# EAGLE design inv_pendulum (EAGLE 7.6.0)
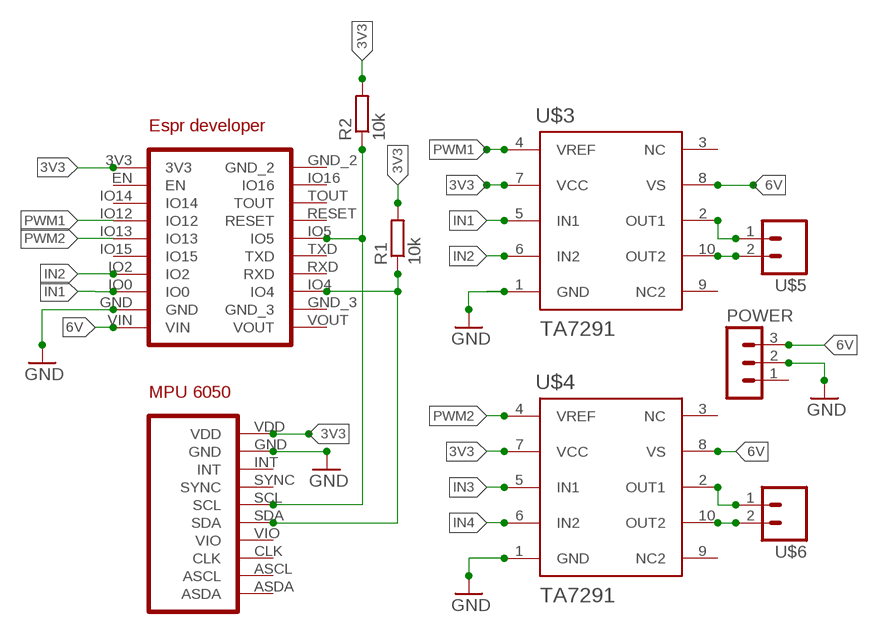
[diagram p0: schematic, sheet 1]

## Parts
POWER  MA03-1  [MA03-1]
R1  10k  R-EU_0204/7  [0204/7]
R2  10k  R-EU_0204/7  [0204/7]
U$1  MPU6050  [MPU6050]
U$2  ESPR_DEVELOPER  [ESPR_DEV]
U$3  TA7291  [HSIP10]
U$4  TA7291  [HSIP10]
U$5  M02LOCK_LONGPADS  [1X02_LOCK_LONGPADS]
U$6  M02LOCK_LONGPADS  [1X02_LOCK_LONGPADS]

## Nets
3V3: R1.2 R2.2 U$1.VDD U$2.3V3 U$3.7(VCC) U$4.7(VCC)
6V: POWER.3 U$2.VIN U$3.8(VS) U$4.8(VS)
GND: POWER.2 U$1.GND U$2.GND U$3.1(GND) U$4.1(GND)
IN1: U$2.IO0 U$3.5(IN1)
IN2: U$2.IO2 U$3.6(IN2)
IN3: U$4.5(IN1)
IN4: U$4.6(IN2)
N$4: U$3.2(OUT1) U$5.1
N$5: U$3.10(OUT2) U$5.2
N$10: U$4.2(OUT1) U$6.1
N$11: U$4.10(OUT2) U$6.2
PWM1: U$2.IO12 U$3.4(VREF)
PWM2: U$2.IO13 U$4.4(VREF)
SCL: R2.1 U$1.SCL U$2.IO5
SDA: R1.1 U$1.SDA U$2.IO4
Unconnected: POWER.1 U$1.ASCL U$1.ASDA U$1.CLK U$1.INT U$1.SYNC U$1.VIO U$2.EN U$2.GND_2 U$2.GND_3 U$2.IO14 U$2.IO15 U$2.IO16 U$2.RESET U$2.RXD U$2.TOUT U$2.TXD U$2.VOUT U$3.3(NC) U$3.9(NC2) U$4.3(NC) U$4.9(NC2)

## Library data of the parts
POWER = con-lstb:MA03-1: PIN HEADER; OC_FARNELL: unknown; OC_NEWARK: unknown
R1 R2 = rcl:R-EU_: RESISTOR, European symbol
U$1 = inv_pendulum:MPU6050
U$2 = Espr_devloper:ESPR_DEVELOPER
U$3 U$4 = TA7291P:TA7291
U$5 U$6 = SparkFun-Connectors:M02: Standard 2-pin 0.1" header. Use with - straight break away headers ( PRT-00116) - right angle break away headers (PRT-00553) - swiss pins (PRT-00743) - machine pins (PRT-00117) - female headers (PRT-00115) Molex polarized connector foot print use with: PRT-08233 with associated crimp pins and housings. 2.54_SCREWTERM for use with PRT-10571. 3.5mm Screw Terminal footprints for PRT-08084 5mm Screw Terminal footprints for use with PRT-08432

## Board
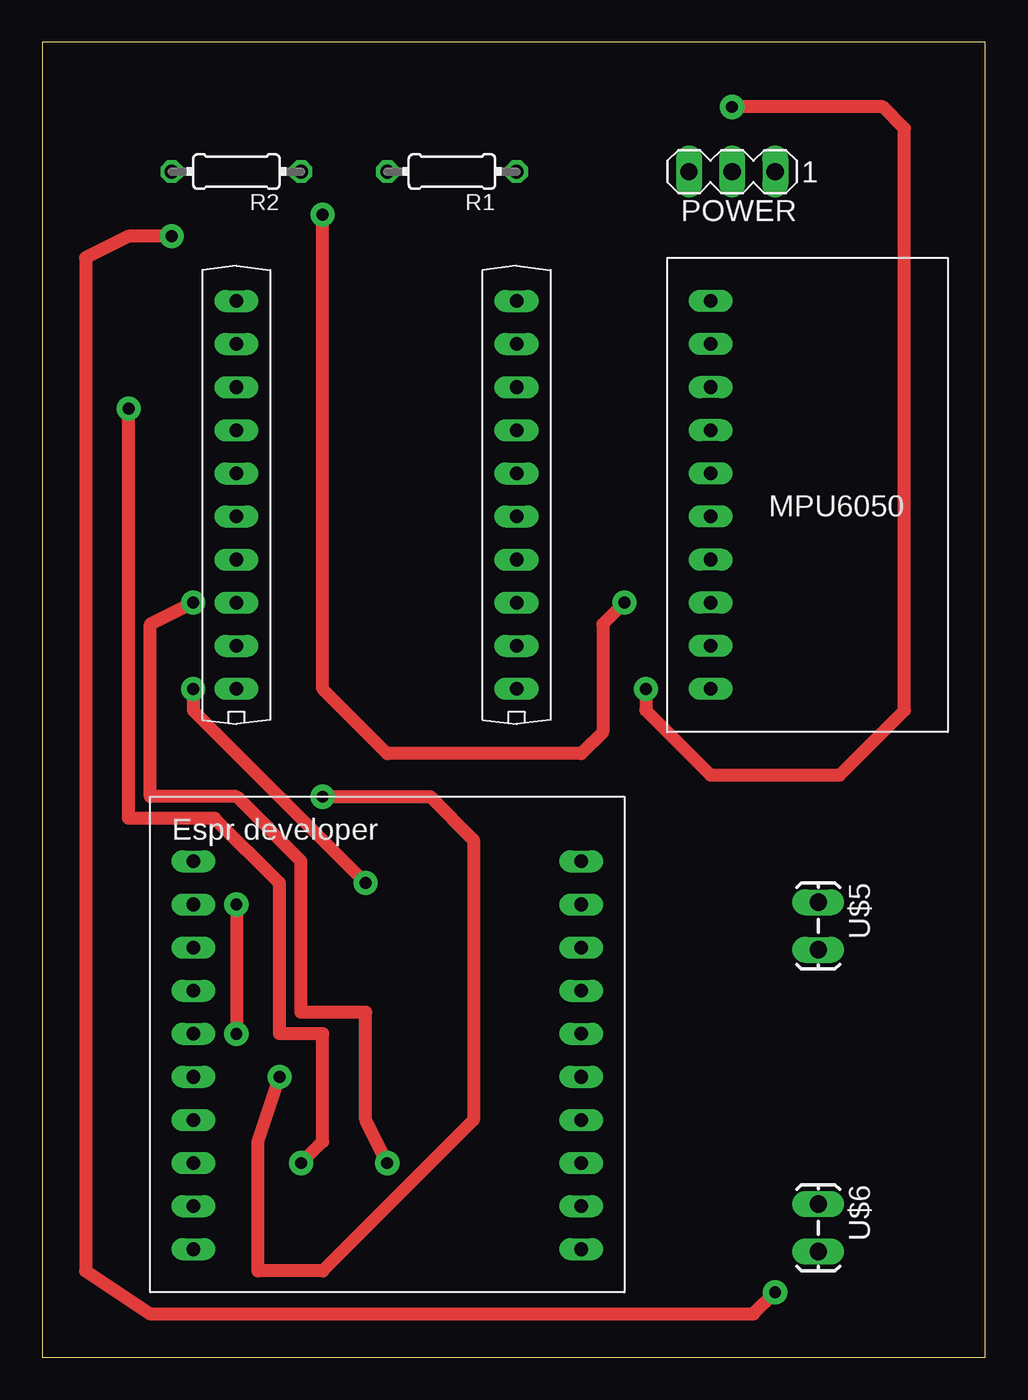
[diagram p1: board, top side]
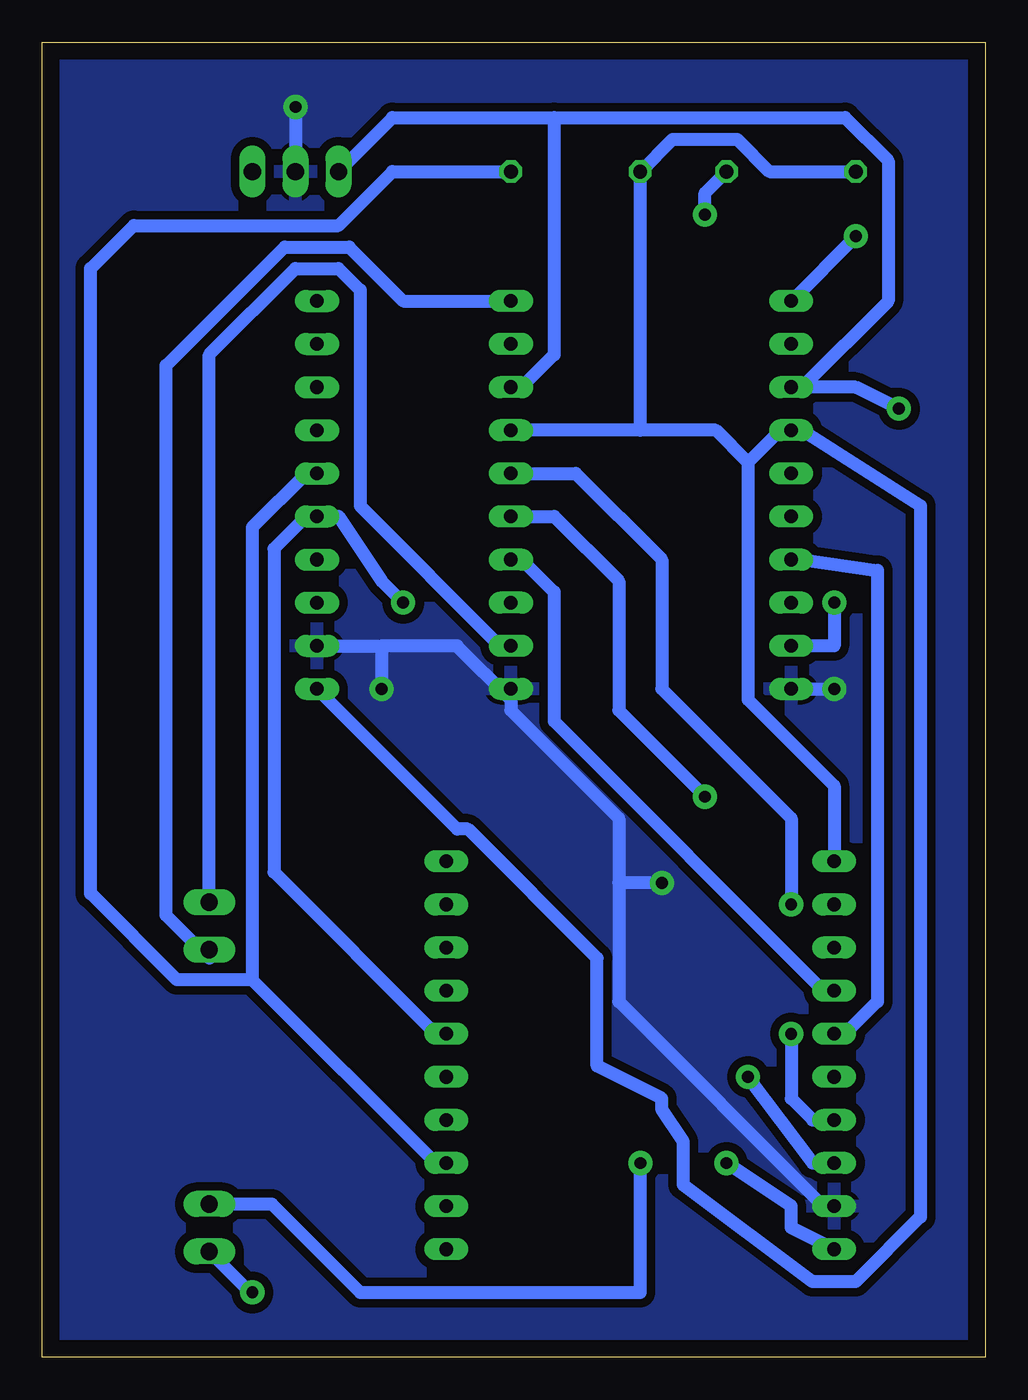
[diagram p2: board, bottom side, seen from below]

Size 55.55 x 77.46 mm. Coordinates in mm from the lower left corner, seen from the top.
Outline: 0,0 55.55,0 55.55,77.46 0,77.46 0,0
Copper layers (1*16): Top 0.035mm / dielectric 1.5mm / Bottom 0.035mm
Design rules "default *": minimum track width 30mil, minimum drill 24mil, track to track 20mil, track to pad 20mil, pad to pad 20mil, via to via 20mil, smd to smd 20mil, copper to edge 40mil, drill to drill 8mil, minimum pad ring 10mil, minimum via ring 8mil, stop-mask expansion 4mil, vias tented up to drill 0mil, thermal gap 10mil

### Footprints (pad centres in the part's own frame; a part is rotated, then mirrored left to right if it is on the bottom)
MA03-1 = drill 1.016 long: 1 -2.54,0; 2 0,0; 3 2.54,0
0204/7 = drill 0.813 octagon: 1 -3.81,0; 2 3.81,0
MPU6050 = drill 0.8 long: ASCL 5.08,-8.89; ASDA 5.08,-11.43; CLK 5.08,-6.35; GND 5.08,8.89; INT 5.08,6.35; SCL 5.08,1.27; SDA 5.08,-1.27; SYNC 5.08,3.81; VDD 5.08,11.43; VIO 5.08,-3.81
ESPR_DEV = drill 0.8 long: 3V3 -15.24,11.43; EN -15.24,8.89; GND -15.24,-8.89; GND_2 7.62,11.43; GND_3 7.62,-8.89; IO0 -15.24,-6.35; IO2 -15.24,-3.81; IO4 7.62,-6.35; IO5 7.62,1.27; IO12 -15.24,3.81; IO13 -15.24,1.27; IO14 -15.24,6.35; IO15 -15.24,-1.27; IO16 7.62,8.89; RESET 7.62,3.81; RXD 7.62,-3.81; TOUT 7.62,6.35; TXD 7.62,-1.27; VIN -15.24,-11.43; VOUT 7.62,-11.43
HSIP10 = drill 0.8 long: 1 -11.43,0; 2 -8.89,0; 3 -6.35,0; 4 -3.81,0; 5 -1.27,0; 6 1.27,0; 7 3.81,0; 8 6.35,0; 9 8.89,0; 10 11.43,0
1X02_LOCK_LONGPADS = drill 1.016 long: 1 -0.127,0; 2 2.667,0

### Placement (x,y rotation side)
POWER  40.64,69.85 180 top
R1  24.13,69.85 180 top
R2  11.43,69.85 180 top
U$1  44.45,50.8 180 top
U$2  24.13,17.78 0 top
U$3  27.94,50.8 90 top
U$4  11.43,50.8 90 top
U$5  45.72,26.67 270 top
U$6  45.72,8.89 270 top

### Tracks (layer width: path | path; a pad name or v marks a point on that pad's centre or on a via)
3V3
  Bottom 0.762: R2.2 12.7,69.85 14.61,71.75 18.41,71.75 R1.2 20.32,54.61 | U$2.3V3 8.89,33.66 13.97,38.74 13.97,52.71 | 13.97,52.71 12.06,54.61 U$4.7 10.79,54.61 3.81,50.17 3.81,8.26 7.62,4.45 10.16,4.45 17.78,10.16 17.78,12.7 19.05,14.61 19.05,15.24 22.86,17.14 22.86,23.5 30.48,31.11 31.11,31.11 U$1.VDD | 20.32,54.61 15.88,54.61 13.97,52.71 | 20.32,54.61 U$3.7
6V  (via drill 0.7 pad 1.42)
  Top 0.762: v15.24,11.43 16.51,12.7 16.51,19.05 13.97,19.05 13.97,27.94 10.16,31.75 5.08,31.75 v5.08,55.88
  Bottom 0.762: 25.4,73.02 34.92,73.02 POWER.3 | 25.4,73.02 8.26,73.02 5.71,70.48 5.71,62.23 10.79,57.15 U$4.8 7.62,57.15 v5.08,55.88 | U$3.8 27.3,57.15 25.4,59.05 25.4,73.02 | U$2.VIN 11.43,7.62 11.43,8.89 v15.24,11.43
GND  (via drill 0.7 pad 1.42)
  Top 0.762: v35.56,39.37 35.56,38.1 39.37,34.29 46.99,34.29 50.8,38.1 50.8,72.39 49.53,73.66 v40.64,73.66 | v8.89,39.37 8.89,38.1 v19.05,27.94
  Bottom 0.762: U$2.GND 9.53,8.89 21.59,20.95 21.59,27.94 | 21.59,27.94 21.59,31.75 27.94,38.1 27.94,38.74 | 35.56,41.91 31.11,41.91 27.94,38.74 | 27.94,38.74 U$3.1 | U$1.GND 35.56,41.91 | 35.56,41.91 v35.56,39.37 | v40.64,73.66 POWER.2 | U$4.1 v8.89,39.37 | v19.05,27.94 21.59,27.94
  pour Bottom: 0,0 55.88,0 55.88,77.47 0,77.47
IN1  (via drill 0.7 pad 1.42)
  Top 0.762: v16.51,33.02 22.86,33.02 25.4,30.48 25.4,13.97 16.51,5.08 12.7,5.08 12.7,12.7 v13.97,16.51
  Bottom 0.762: U$3.5 25.4,49.53 21.59,45.72 21.59,38.1 v16.51,33.02 | v13.97,16.51 10.16,11.43 U$2.IO0
IN2  (via drill 0.7 pad 1.42)
  Top 0.762: v11.43,26.67 v11.43,19.05
  Bottom 0.762: U$3.6 24.13,52.07 19.05,46.99 19.05,39.37 11.43,31.75 v11.43,26.67 | v11.43,19.05 11.43,15.24 10.16,13.97 U$2.IO2
N$4
  Bottom 0.762: U$3.2 28.57,41.91 36.83,50.17 36.83,62.87 38.1,64.14 40.64,64.14 45.72,59.05 U$5.1
N$5
  Bottom 0.762: U$3.10 34.29,62.23 37.47,65.41 41.27,65.41 48.26,58.42 48.26,26.04 45.72,23.5 U$5.2
N$10  (via drill 0.7 pad 1.42)
  Top 0.762: v20.32,11.43 19.05,13.97 19.05,20.32 15.24,20.32 15.24,29.21 11.43,33.02 6.35,33.02 6.35,43.18 v8.89,44.45
  Bottom 0.762: U$6.1 42.04,9.02 36.83,3.81 20.32,3.81 v20.32,11.43 | v8.89,44.45 8.89,41.91 U$4.2
N$11  (via drill 0.7 pad 1.42)
  Top 0.762: v7.62,66.04 5.08,66.04 2.54,64.77 2.54,5.08 6.35,2.54 41.91,2.54 v43.18,3.81
  Bottom 0.762: U$4.10 v7.62,66.04 | v43.18,3.81 43.31,3.81 U$6.2
PWM1
  Bottom 0.762: U$2.IO12 9.53,21.59 25.4,37.47 25.4,45.09 27.3,46.99 U$3.4
PWM2
  Bottom 0.762: U$2.IO13 8.26,19.05 6.35,20.95 6.35,46.36 10.79,46.99 U$4.4
SCL  (via drill 0.7 pad 1.42)
  Top 0.762: v34.29,44.45 33.02,43.18 33.02,36.83 31.75,35.56 20.32,35.56 16.51,39.37 v16.51,67.31
  Bottom 0.762: U$2.IO5 32.38,19.05 41.91,28.57 41.91,47.62 40.01,49.53 U$1.SCL 38.1,49.53 35.56,45.72 v34.29,44.45 | v16.51,67.31 16.51,68.58 R2.1
SDA
  Bottom 0.762: U$2.IO4 32.38,11.43 43.18,22.22 | 43.18,22.22 43.18,48.9 40.01,52.07 U$1.SDA | R1.1 34.92,69.85 38.1,66.67 50.16,66.67 52.7,64.14 52.7,27.3 47.62,22.22 43.18,22.22